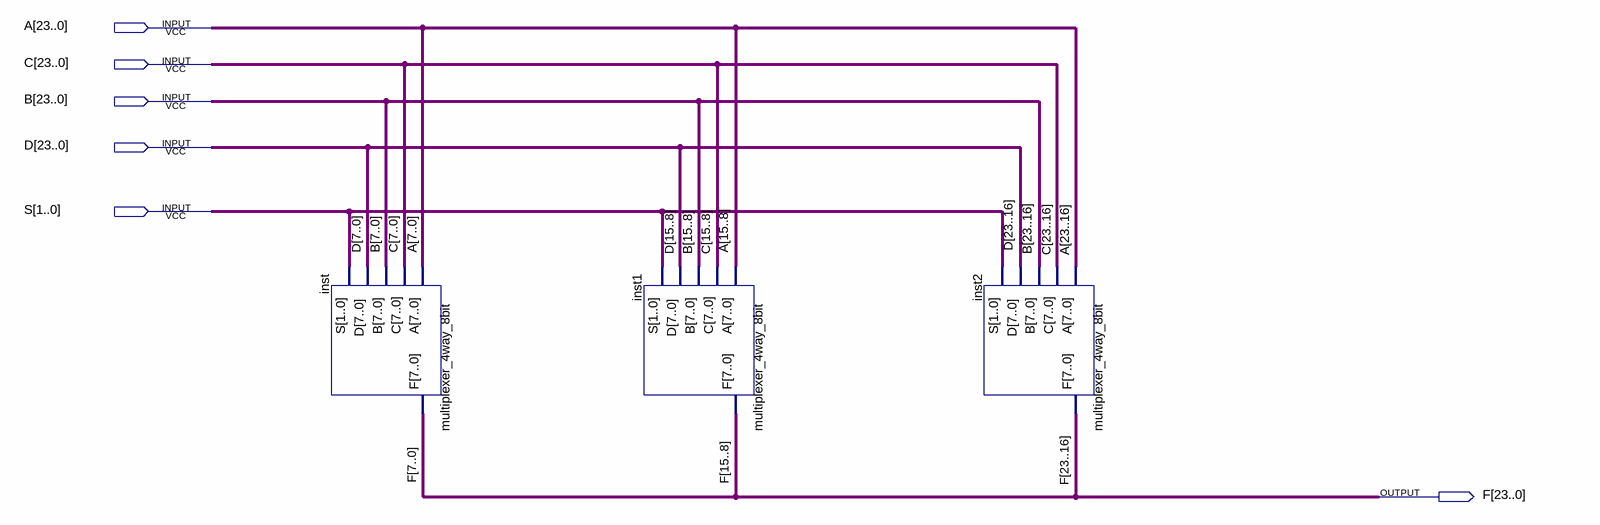
[diagram p0: schematic sheet]
// Quartus schematic multiplexer_4way_24bit.bdf as structural Verilog: 3 symbols, 6 pins
module multiplexer_4way_24bit (
  input  [23:0] A,
  input  [23:0] C,
  input  [23:0] B,
  input  [23:0] D,
  input  [1:0] S,
  output [23:0] F
);

  multiplexer_4way_8bit inst (.A(A[7:0]), .C(C[7:0]), .B(B[7:0]), .D(D[7:0]), .S(S), .F(F[7:0]));
  multiplexer_4way_8bit inst1 (.A(A[15:8]), .C(C[15:8]), .B(B[15:8]), .D(D[15:8]), .S(S), .F(F[15:8]));
  multiplexer_4way_8bit inst2 (.A(A[23:16]), .C(C[23:16]), .B(B[23:16]), .D(D[23:16]), .S(S), .F(F[23:16]));
endmodule
